# EAGLE schematic clouds_v30 (EAGLE 7.5.0)

## Sheet 1 of 4
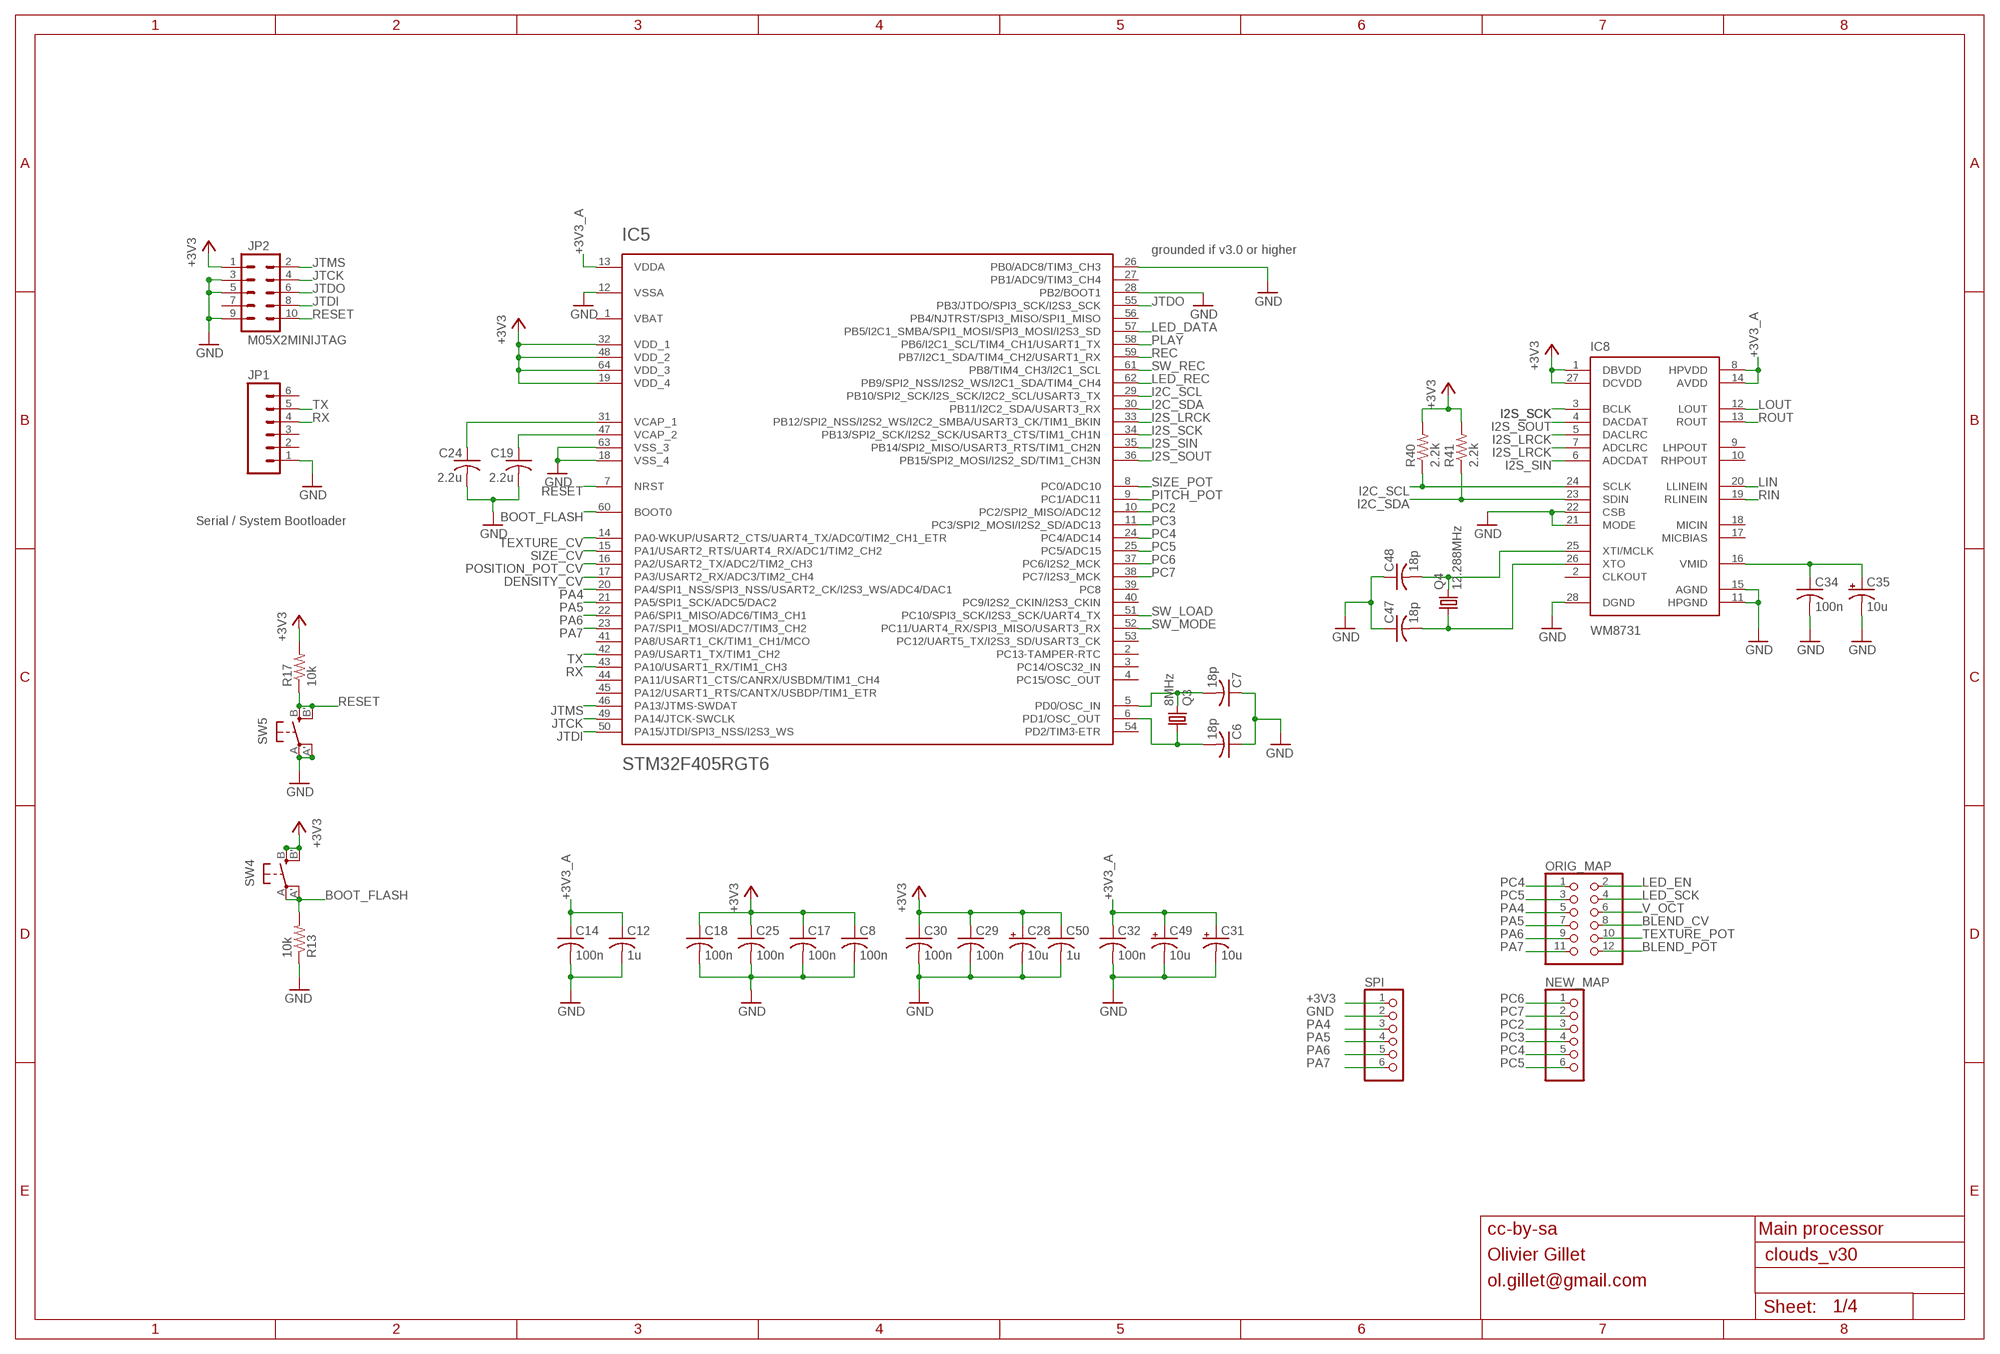
[diagram p0: schematic, sheet 1]

### Parts
C6  18p  C-USC0603  [C0603]
C7  18p  C-USC0603  [C0603]
C8  100n  C-USC0603  [C0603]
C12  1u  C-USC0603  [C0603]
C14  100n  C-USC0603  [C0603]
C17  100n  C-USC0603  [C0603]
C18  100n  C-USC0603  [C0603]
C19  2.2u  C-USC0805  [C0805]
C24  2.2u  C-USC0805  [C0805]
C25  100n  C-USC0603  [C0603]
C28  10u  CPOL-USA  [PANASONIC_A]
C29  100n  C-USC0603  [C0603]
C30  100n  C-USC0603  [C0603]
C31  10u  CPOL-USB  [PANASONIC_B]
C32  100n  C-USC0603  [C0603]
C34  100n  C-USC0603  [C0603]
C35  10u  CPOL-USB  [PANASONIC_B]
C47  18p  C-USC0603  [C0603]
C48  18p  C-USC0603  [C0603]
C49  10u  CPOL-USA  [PANASONIC_A]
C50  1u  C-USC0603  [C0603]
IC5  STM32F405RGT6  STM32F20X  [TQFP-10X10-64]
IC8  WM8731  [SSOP28]
JP1  M06SIP  [1X06]
JP2  M05X2MINIJTAG  [2X5-1.27]
NEW_MAP  PINHD-1X6  [1X06]
ORIG_MAP  PINHD-2X6  [2X06]
Q3  8MHz  CRYSTALHC49UP  [HC49UP]
Q4  12.288MHz  CRYSTALHC49UP  [HC49UP]
R13  10k  R-US_R0603  [R0603]
R17  10k  R-US_R0603  [R0603]
R40  2.2k  R-US_R0603  [R0603]
R41  2.2k  R-US_R0603  [R0603]
SPI  PINHD-1X6  [1X06]
SW4  EVQQ2  [EVQ-Q2]
SW5  EVQQ2  [EVQ-Q2]

### Nets
+3V3: C8.1 C17.1 C18.1 C25.1 C28.+ C29.1 C30.1 C50.1 IC5.19(VDD_4) IC5.32(VDD_1) IC5.48(VDD_2) IC5.64(VDD_3) IC8.1(DBVDD) IC8.27(DCVDD) JP2.1 R17.2 R40.2 R41.2 SPI.1 SW4.B'(S1) SW4.B(S) ; also sheet 3,4
+3V3_A: C12.1 C14.1 C31.+ C32.1 C49.+ IC5.13(VDDA) IC8.8(HPVDD) IC8.14(AVDD) ; also sheet 2,3,4
BLEND_CV: ORIG_MAP.8 ; also sheet 2
BLEND_POT: ORIG_MAP.12 ; also sheet 3
BOOT_FLASH: IC5.60(BOOT0) R13.2 SW4.A'(P1) SW4.A(P)
DENSITY_CV: IC5.17(PA3/USART2_RX/ADC3/TIM2_CH4) ; also sheet 2
GND: C6.1 C7.1 C8.2 C12.2 C14.2 C17.2 C18.2 C19.2 C24.2 C25.2 C28.- C29.2 C30.2 C31.- C32.2 C34.2 C35.- C47.1 C48.1 C49.- C50.2 IC5.12(VSSA) IC5.18(VSS_4) IC5.26(PB0/ADC8/TIM3_CH3) IC5.28(PB2/BOOT1) IC5.63(VSS_3) IC8.11(HPGND) IC8.15(AGND) IC8.21(MODE) IC8.22(CSB) IC8.28(DGND) JP1.1 JP2.3 JP2.5 JP2.9 R13.1 SPI.2 SW5.A'(P1) SW5.A(P) ; also sheet 2,3,4
I2C_SCL: IC5.29(PB10/SPI2_SCK/I2S_SCK/I2C2_SCL/USART3_TX) IC8.24(SCLK) R40.1
I2C_SDA: IC5.30(PB11/I2C2_SDA/USART3_RX) IC8.23(SDIN) R41.1
I2S_LRCK: IC5.33(PB12/SPI2_NSS/I2S2_WS/I2C2_SMBA/USART3_CK/TIM1_BKIN) IC8.5(DACLRC) IC8.7(ADCLRC)
I2S_SCK: IC5.34(PB13/SPI2_SCK/I2S2_SCK/USART3_CTS/TIM1_CH1N) IC8.3(BCLK)
I2S_SIN: IC5.35(PB14/SPI2_MISO/USART3_RTS/TIM1_CH2N) IC8.6(ADCDAT)
I2S_SOUT: IC5.36(PB15/SPI2_MOSI/I2S2_SD/TIM1_CH3N) IC8.4(DACDAT)
JTCK: IC5.49(PA14/JTCK-SWCLK) JP2.4
JTDI: IC5.50(PA15/JTDI/SPI3_NSS/I2S3_WS) JP2.8
JTDO: IC5.55(PB3/JTDO/SPI3_SCK/I2S3_SCK) JP2.6
JTMS: IC5.46(PA13/JTMS-SWDAT) JP2.2
LED_DATA: IC5.57(PB5/I2C1_SMBA/SPI1_MOSI/SPI3_MOSI/I2S3_SD) ; also sheet 3
LED_EN: ORIG_MAP.2 ; also sheet 3
LED_REC: IC5.62(PB9/SPI2_NSS/I2S2_WS/I2C1_SDA/TIM4_CH4) ; also sheet 3
LED_SCK: ORIG_MAP.4 ; also sheet 3
LIN: IC8.20(LLINEIN) ; also sheet 2
LOUT: IC8.12(LOUT) ; also sheet 2
N$7: C7.2 IC5.5(PD0/OSC_IN) Q3.2
N$8: C6.2 IC5.6(PD1/OSC_OUT) Q3.1
N$13: C19.1 IC5.47(VCAP_2)
N$17: C34.1 C35.+ IC8.16(VMID)
N$19: C24.1 IC5.31(VCAP_1)
N$59: C47.2 IC8.26(XTO) Q4.1
N$60: C48.2 IC8.25(XTI/MCLK) Q4.2
PA4: IC5.20(PA4/SPI1_NSS/SPI3_NSS/USART2_CK/I2S3_WS/ADC4/DAC1) ORIG_MAP.5 SPI.3
PA5: IC5.21(PA5/SPI1_SCK/ADC5/DAC2) ORIG_MAP.7 SPI.4
PA6: IC5.22(PA6/SPI1_MISO/ADC6/TIM3_CH1) ORIG_MAP.9 SPI.5
PA7: IC5.23(PA7/SPI1_MOSI/ADC7/TIM3_CH2) ORIG_MAP.11 SPI.6
PC2: IC5.10(PC2/SPI2_MISO/ADC12) NEW_MAP.3
PC3: IC5.11(PC3/SPI2_MOSI/I2S2_SD/ADC13) NEW_MAP.4
PC4: IC5.24(PC4/ADC14) NEW_MAP.5 ORIG_MAP.1
PC5: IC5.25(PC5/ADC15) NEW_MAP.6 ORIG_MAP.3
PC6: IC5.37(PC6/I2S2_MCK) NEW_MAP.1
PC7: IC5.38(PC7/I2S3_MCK) NEW_MAP.2
PITCH_POT: IC5.9(PC1/ADC11) ; also sheet 3
PLAY: IC5.58(PB6/I2C1_SCL/TIM4_CH1/USART1_TX) ; also sheet 3
POSITION_POT_CV: IC5.16(PA2/USART2_TX/ADC2/TIM2_CH3) ; also sheet 2
REC: IC5.59(PB7/I2C1_SDA/TIM4_CH2/USART1_RX) ; also sheet 3
RESET: IC5.7(NRST) JP2.10 R17.1 SW5.B'(S1) SW5.B(S)
RIN: IC8.19(RLINEIN) ; also sheet 2
ROUT: IC8.13(ROUT) ; also sheet 2
RX: IC5.43(PA10/USART1_RX/TIM1_CH3) JP1.4
SIZE_CV: IC5.15(PA1/USART2_RTS/UART4_RX/ADC1/TIM2_CH2) ; also sheet 2
SIZE_POT: IC5.8(PC0/ADC10) ; also sheet 3
SW_LOAD: IC5.51(PC10/SPI3_SCK/I2S3_SCK/UART4_TX) ; also sheet 3
SW_MODE: IC5.52(PC11/UART4_RX/SPI3_MISO/USART3_RX) ; also sheet 3
SW_REC: IC5.61(PB8/TIM4_CH3/I2C1_SCL) ; also sheet 3
TEXTURE_CV: IC5.14(PA0-WKUP/USART2_CTS/UART4_TX/ADC0/TIM2_CH1_ETR) ; also sheet 2
TEXTURE_POT: ORIG_MAP.10 ; also sheet 3
TX: IC5.42(PA9/USART1_TX/TIM1_CH2) JP1.5
V_OCT: ORIG_MAP.6 ; also sheet 2
Unconnected: IC5.2(PC13-TAMPER-RTC) IC5.3(PC14/OSC32_IN) IC5.4(PC15/OSC_OUT) IC5.27(PB1/ADC9/TIM3_CH4) IC5.39(PC8) IC5.40(PC9/I2S2_CKIN/I2S3_CKIN) IC5.41(PA8/USART1_CK/TIM1_CH1/MCO) IC5.44(PA11/USART1_CTS/CANRX/USBDM/TIM1_CH4) IC5.45(PA12/USART1_RTS/CANTX/USBDP/TIM1_ETR) IC5.53(PC12/UART5_TX/I2S3_SD/USART3_CK) IC5.54(PD2/TIM3-ETR) IC5.56(PB4/NJTRST/SPI3_MISO/SPI1_MISO) IC8.2(CLKOUT) IC8.9(LHPOUT) IC8.10(RHPOUT) IC8.17(MICBIAS) IC8.18(MICIN) JP1.2 JP1.3 JP1.6 JP2.7

### Notes on the sheet
- grounded if v3.0 or higher
- Serial / System Bootloader
- cc-by-sa | Main processor
- Olivier Gillet
- ol.gillet@gmail.com

## Sheet 2 of 4
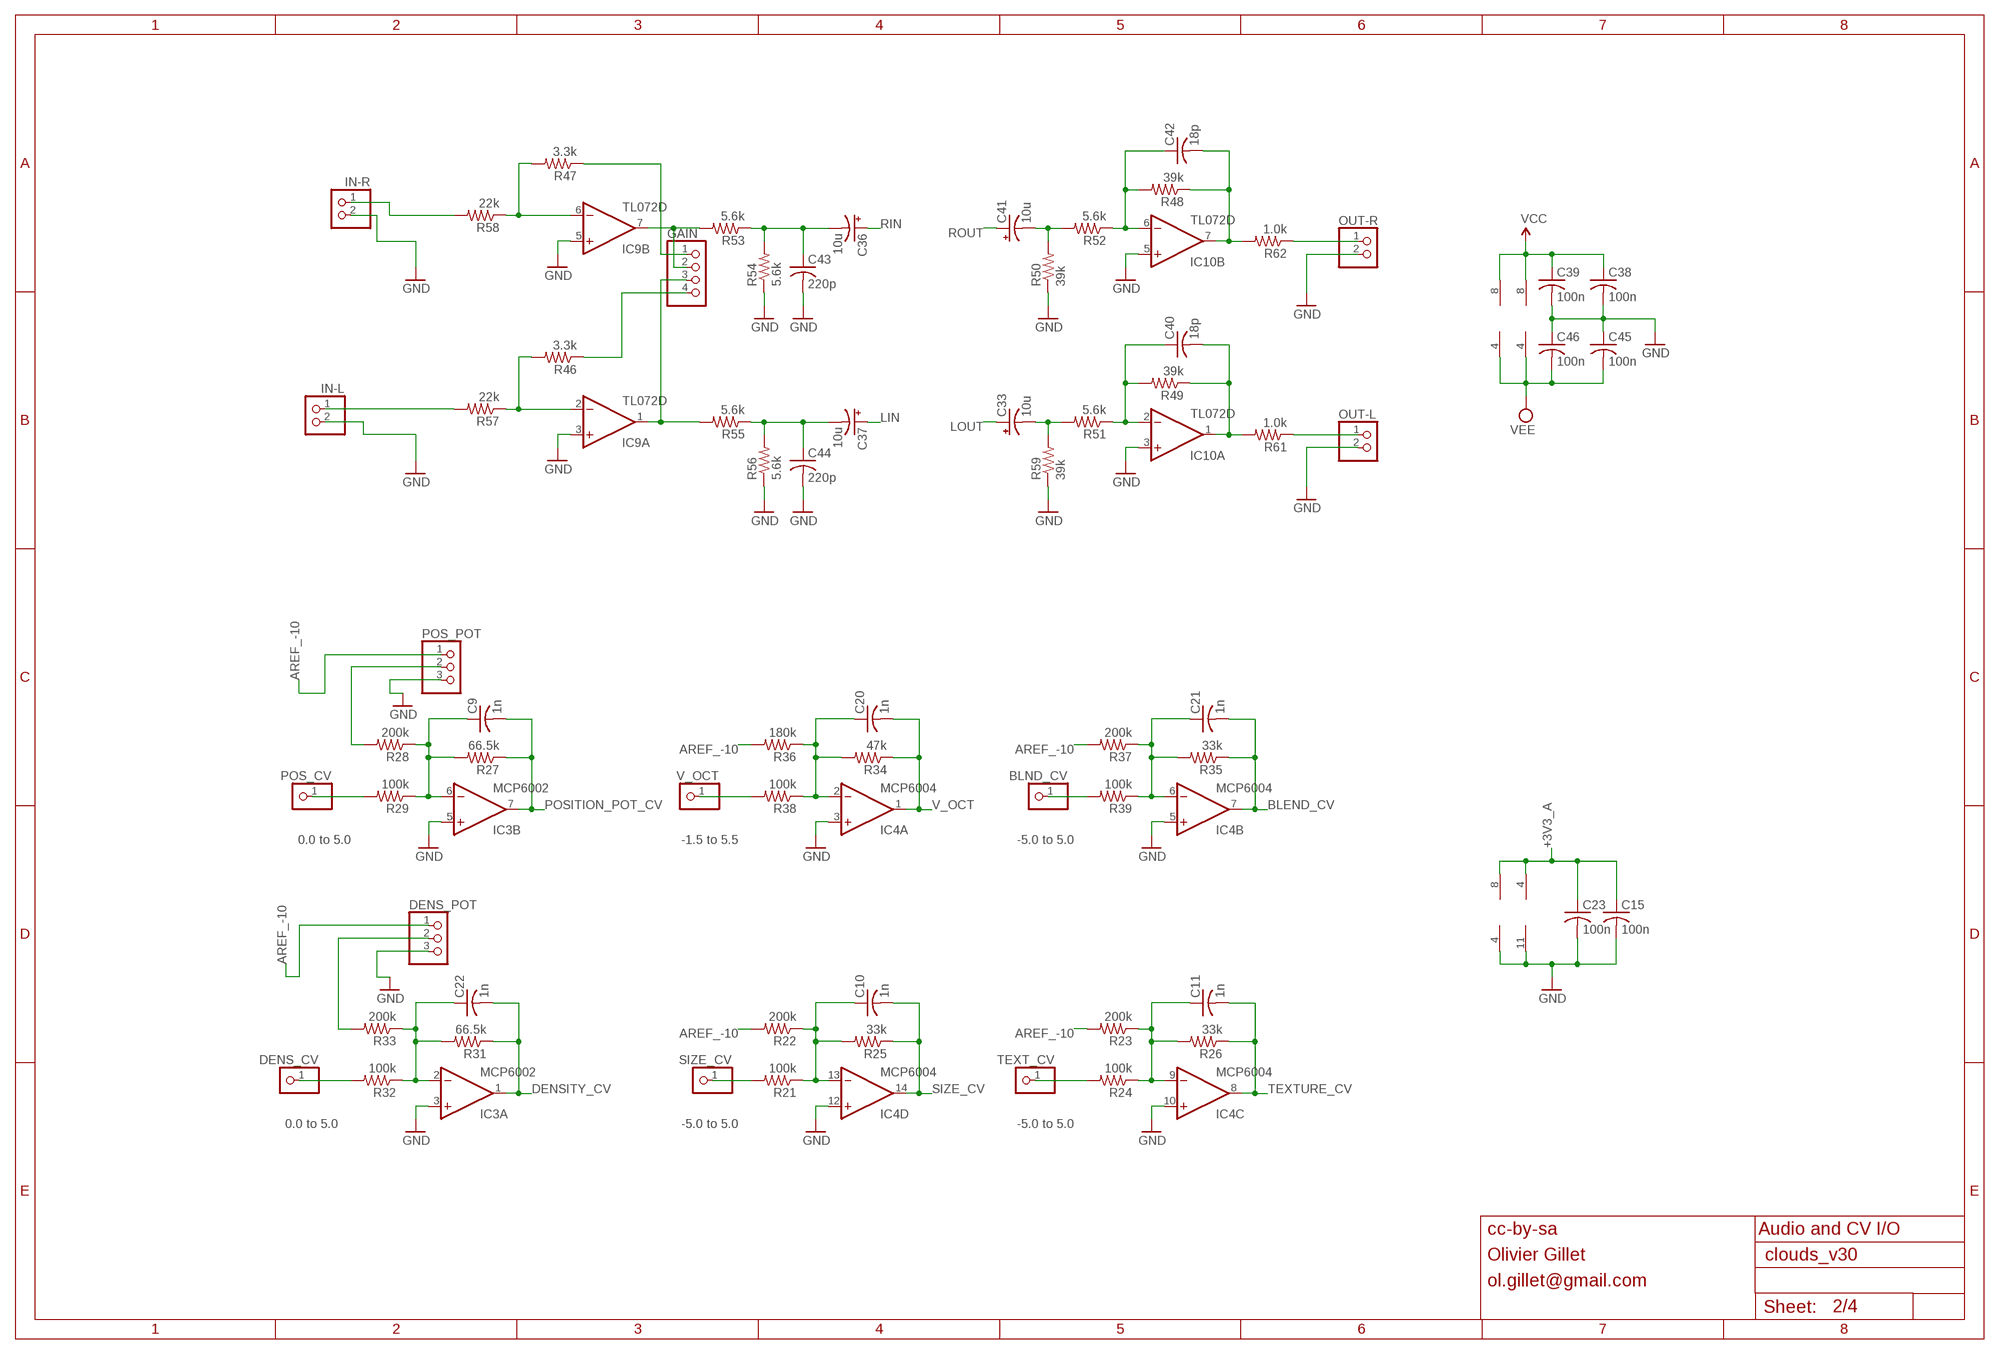
[diagram p1: schematic, sheet 2]

### Parts
BLND_CV  PINHD-1X1  [1X01]
C9  1n  C-USC0603  [C0603]
C10  1n  C-USC0603  [C0603]
C11  1n  C-USC0603  [C0603]
C15  100n  C-USC0603  [C0603]
C20  1n  C-USC0603  [C0603]
C21  1n  C-USC0603  [C0603]
C22  1n  C-USC0603  [C0603]
C23  100n  C-USC0603  [C0603]
C33  10u  CPOL-USB  [PANASONIC_B]
C36  10u  CPOL-USB  [PANASONIC_B]
C37  10u  CPOL-USB  [PANASONIC_B]
C38  100n  C-USC0603  [C0603]
C39  100n  C-USC0603  [C0603]
C40  18p  C-USC0603  [C0603]
C41  10u  CPOL-USB  [PANASONIC_B]
C42  18p  C-USC0603  [C0603]
C43  220p  C-USC0603  [C0603]
C44  220p  C-USC0603  [C0603]
C45  100n  C-USC0603  [C0603]
C46  100n  C-USC0603  [C0603]
DENS_CV  PINHD-1X1  [1X01]
DENS_POT  PINHD-1X3  [1X03]
GAIN  PINHD-1X4  [1X04]
IC3  MCP6002  TL072D  [SO08]
IC4  MCP6004  TL074D  [SO14]
IC9  TL072D  [SO08]
IC10  TL072D  [SO08]
IN-L  PINHD-1X2  [1X02]
IN-R  PINHD-1X2  [1X02]
OUT-L  PINHD-1X2  [1X02]
OUT-R  PINHD-1X2  [1X02]
POS_CV  PINHD-1X1  [1X01]
POS_POT  PINHD-1X3  [1X03]
R21  100k  R-US_R0603  [R0603]
R22  200k  R-US_R0603  [R0603]
R23  200k  R-US_R0603  [R0603]
R24  100k  R-US_R0603  [R0603]
R25  33k  R-US_R0603  [R0603]
R26  33k  R-US_R0603  [R0603]
R27  66.5k  R-US_R0603  [R0603]
R28  200k  R-US_R0603  [R0603]
R29  100k  R-US_R0603  [R0603]
R31  66.5k  R-US_R0603  [R0603]
R32  100k  R-US_R0603  [R0603]
R33  200k  R-US_R0603  [R0603]
R34  47k  R-US_R0603  [R0603]
R35  33k  R-US_R0603  [R0603]
R36  180k  R-US_R0603  [R0603]
R37  200k  R-US_R0603  [R0603]
R38  100k  R-US_R0603  [R0603]
R39  100k  R-US_R0603  [R0603]
R46  3.3k  R-US_R0603  [R0603]
R47  3.3k  R-US_R0603  [R0603]
R48  39k  R-US_R0603  [R0603]
R49  39k  R-US_R0603  [R0603]
R50  39k  R-US_R0603  [R0603]
R51  5.6k  R-US_R0603  [R0603]
R52  5.6k  R-US_R0603  [R0603]
R53  5.6k  R-US_R0603  [R0603]
R54  5.6k  R-US_R0603  [R0603]
R55  5.6k  R-US_R0603  [R0603]
R56  5.6k  R-US_R0603  [R0603]
R57  22k  R-US_R0603  [R0603]
R58  22k  R-US_R0603  [R0603]
R59  39k  R-US_R0603  [R0603]
R61  1.0k  R-US_R0603  [R0603]
R62  1.0k  R-US_R0603  [R0603]
SIZE_CV  PINHD-1X1  [1X01]
TEXT_CV  PINHD-1X1  [1X01]
V_OCT  PINHD-1X1  [1X01]

### Nets
+3V3_A: C15.1 C23.1 IC3.8(P:V+) IC4.4(P:V+) ; also sheet 1,3,4
AREF_-10: DENS_POT.1 POS_POT.1 R22.2 R23.2 R36.2 R37.2 ; also sheet 4
BLEND_CV: C21.2 IC4.7(B:OUT) R35.1 ; also sheet 1
DENSITY_CV: C22.2 IC3.1(A:OUT) R31.1 ; also sheet 1
GND: C15.2 C23.2 C38.2 C39.2 C43.2 C44.2 C45.1 C46.1 DENS_POT.3 IC3.3(A:+IN) IC3.4(P:V-) IC3.5(B:+IN) IC4.3(A:+IN) IC4.5(B:+IN) IC4.10(C:+IN) IC4.11(P:V-) IC4.12(D:+IN) IC9.3(A:+IN) IC9.5(B:+IN) IC10.3(A:+IN) IC10.5(B:+IN) IN-L.2 IN-R.2 OUT-L.2 OUT-R.2 POS_POT.3 R50.1 R54.1 R56.1 R59.1 ; also sheet 1,3,4
LIN: C37.+ ; also sheet 1
LOUT: C33.+ ; also sheet 1
LOUT_JACK: OUT-L.1 R61.1
N$1: R21.2 SIZE_CV.1
N$2: C10.1 IC4.13(D:-IN) R21.1 R22.1 R25.2
N$4: R24.2 TEXT_CV.1
N$5: C11.1 IC4.9(C:-IN) R23.1 R24.1 R26.2
N$6: BLND_CV.1 R39.2
N$10: R38.2 V_OCT.1
N$11: C20.1 IC4.2(A:-IN) R34.2 R36.1 R38.1
N$14: DENS_CV.1 R32.2
N$15: C21.1 IC4.6(B:-IN) R35.2 R37.1 R39.1
N$18: C37.- C44.1 R55.1 R56.2
N$20: IN-R.1 R58.2
N$21: IN-L.1 R57.2
N$22: C36.- C43.1 R53.1 R54.2
N$23: C41.- R50.2 R52.2
N$24: C22.1 IC3.2(A:-IN) R31.2 R32.1 R33.1
N$25: C42.1 IC10.6(B:-IN) R48.2 R52.1
N$26: DENS_POT.2 R33.2
N$27: POS_CV.1 R29.2
N$28: C42.2 IC10.7(B:OUT) R48.1 R62.2
N$30: C9.1 IC3.6(B:-IN) R27.2 R28.1 R29.1
N$31: C33.- R51.2 R59.2
N$32: C40.1 IC10.2(A:-IN) R49.2 R51.1
N$33: C40.2 IC10.1(A:OUT) R49.1 R61.2
N$35: POS_POT.2 R28.2
N$42: GAIN.2 IC9.7(B:OUT) R53.2
N$51: GAIN.3 IC9.1(A:OUT) R55.2
N$52: GAIN.1 R47.1
N$53: GAIN.4 R46.1
N$54: IC9.6(B:-IN) R47.2 R58.1
N$58: IC9.2(A:-IN) R46.2 R57.1
POSITION_POT_CV: C9.2 IC3.7(B:OUT) R27.1 ; also sheet 1
RIN: C36.+ ; also sheet 1
ROUT: C41.+ ; also sheet 1
ROUT_JACK: OUT-R.1 R62.1
SIZE_CV: C10.2 IC4.14(D:OUT) R25.1 ; also sheet 1
TEXTURE_CV: C11.2 IC4.8(C:OUT) R26.1 ; also sheet 1
V_OCT: C20.2 IC4.1(A:OUT) R34.1 ; also sheet 1
VCC: C38.1 C39.1 IC9.8(P:V+) IC10.8(P:V+) ; also sheet 4
VEE: C45.2 C46.2 IC9.4(P:V-) IC10.4(P:V-) ; also sheet 4

### Notes on the sheet
- 0.0 to 5.0 | -1.5 to 5.5 | -5.0 to 5.0
- 0.0 to 5.0 | -5.0 to 5.0 | -5.0 to 5.0
- cc-by-sa | Audio and CV I/O
- Olivier Gillet
- ol.gillet@gmail.com

## Sheet 3 of 4
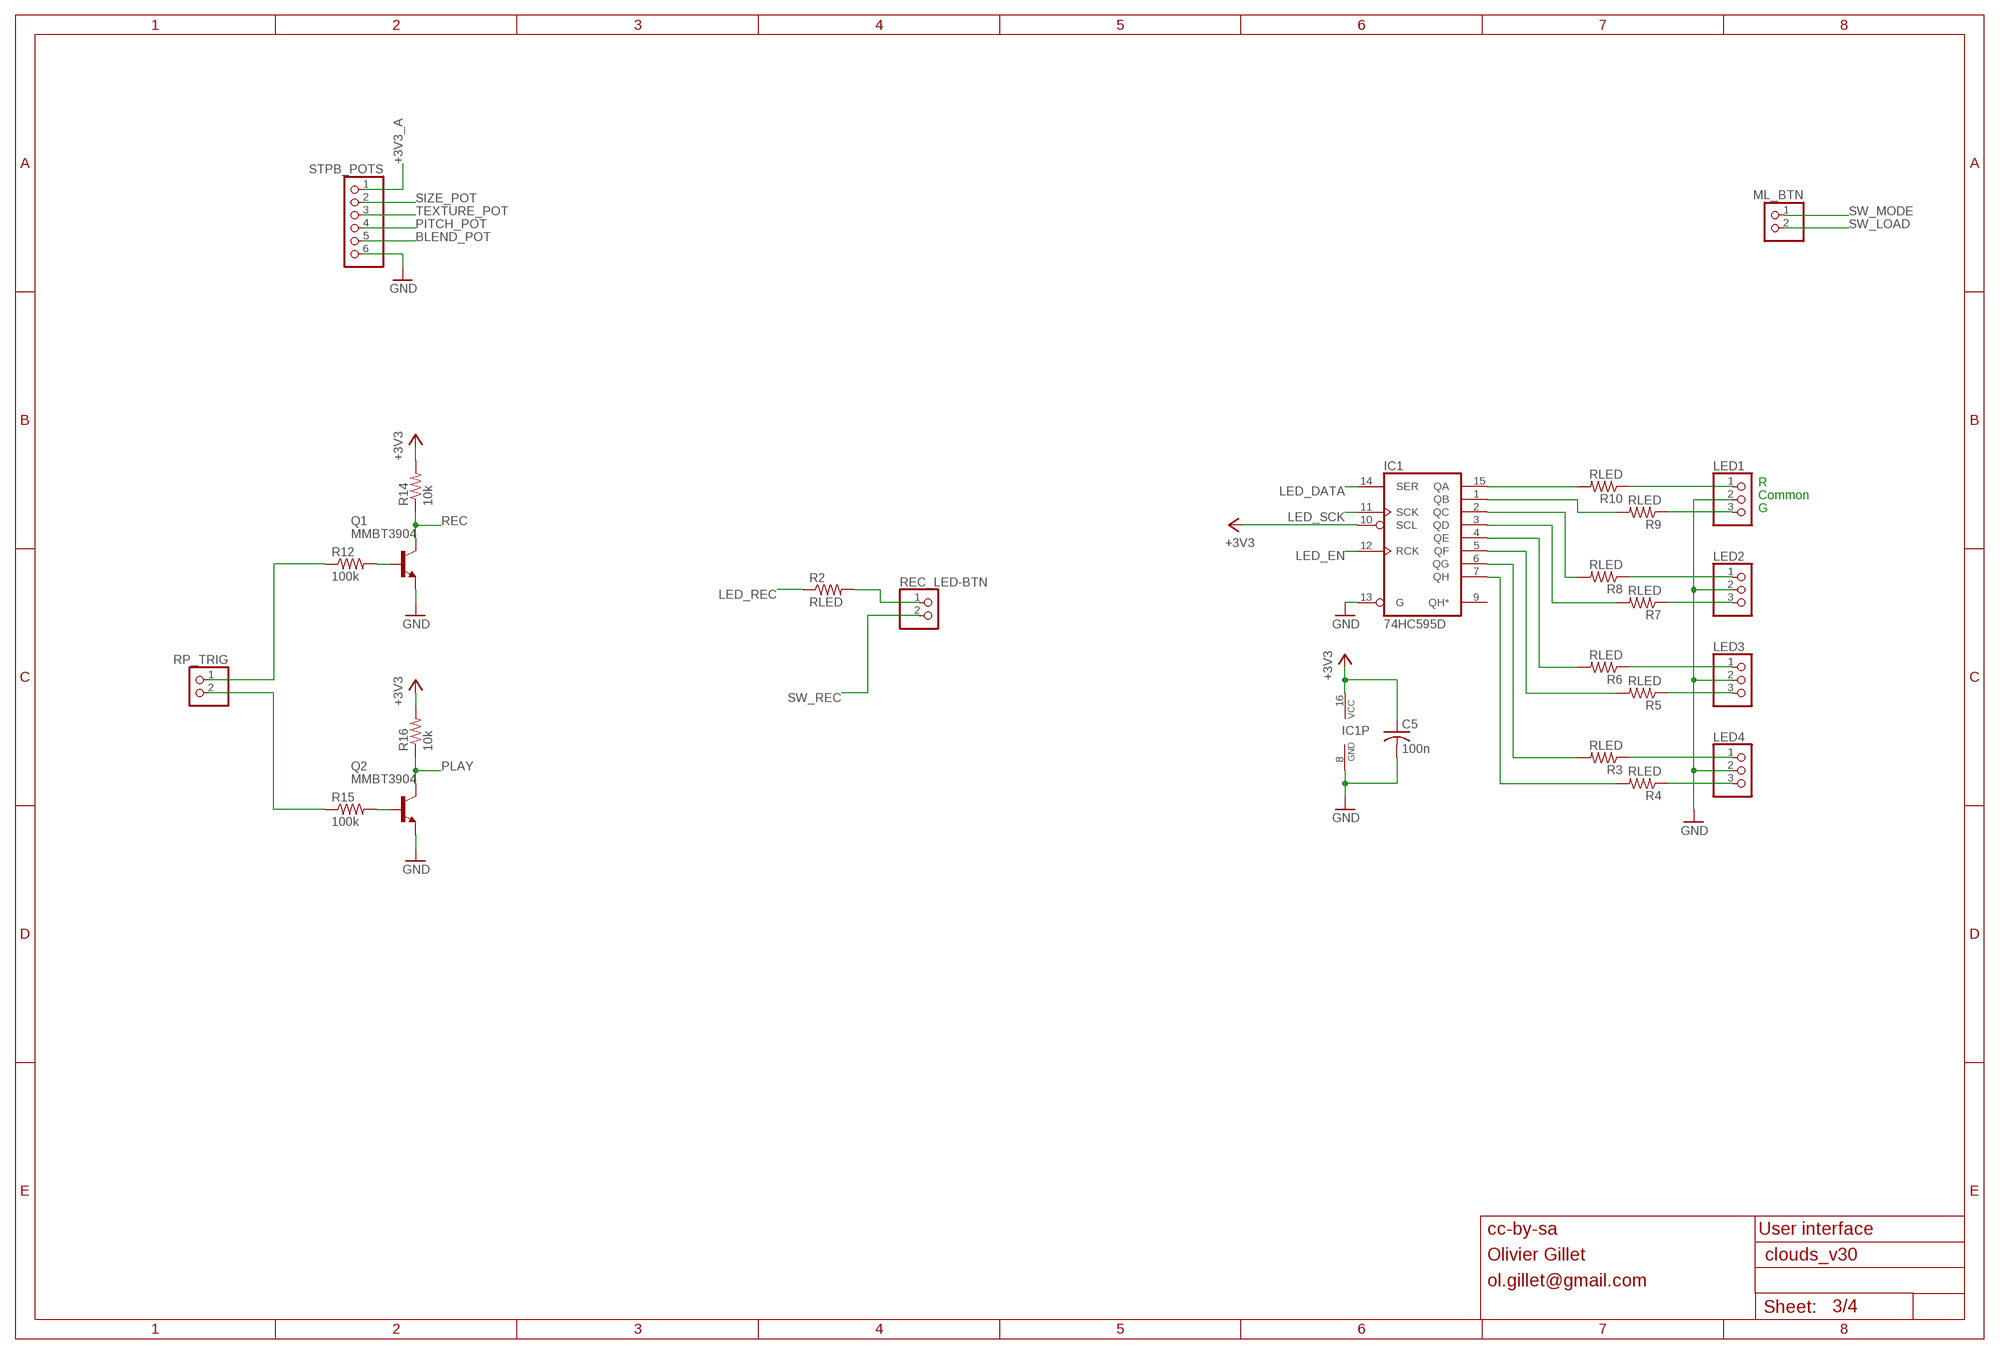
[diagram p2: schematic, sheet 3]

### Parts
C5  100n  C-USC0603  [C0603]
IC1  74HC595D  [SO16]
LED1  PINHD-1X3  [1X03]
LED2  PINHD-1X3  [1X03]
LED3  PINHD-1X3  [1X03]
LED4  PINHD-1X3  [1X03]
ML_BTN  PINHD-1X2  [1X02]
Q1  MMBT3904  MMBT3904LT1-NPN-SOT23-BEC  [SOT23-BEC]
Q2  MMBT3904  MMBT3904LT1-NPN-SOT23-BEC  [SOT23-BEC]
R2  RLED  R-US_R0603  [R0603]
R3  RLED  R-US_R0603  [R0603]
R4  RLED  R-US_R0603  [R0603]
R5  RLED  R-US_R0603  [R0603]
R6  RLED  R-US_R0603  [R0603]
R7  RLED  R-US_R0603  [R0603]
R8  RLED  R-US_R0603  [R0603]
R9  RLED  R-US_R0603  [R0603]
R10  RLED  R-US_R0603  [R0603]
R12  100k  R-US_R0603  [R0603]
R14  10k  R-US_R0603  [R0603]
R15  100k  R-US_R0603  [R0603]
R16  10k  R-US_R0603  [R0603]
REC_LED-BTN  PINHD-1X2  [1X02]
RP_TRIG  PINHD-1X2  [1X02]
STPB_POTS  PINHD-1X6  [1X06]

### Nets
+3V3: C5.1 IC1.10(SCL) IC1.16(VCC) R14.2 R16.2 ; also sheet 1,4
+3V3_A: STPB_POTS.1 ; also sheet 1,2,4
BLEND_POT: STPB_POTS.5 ; also sheet 1
GND: C5.2 IC1.8(GND) IC1.13(G) LED1.2 LED2.2 LED3.2 LED4.2 Q1.E Q2.E STPB_POTS.6 ; also sheet 1,2,4
LED_DATA: IC1.14(SER) ; also sheet 1
LED_EN: IC1.12(RCK) ; also sheet 1
LED_REC: R2.1 ; also sheet 1
LED_SCK: IC1.11(SCK) ; also sheet 1
N$9: LED1.3 R9.1
N$12: LED1.1 R10.1
N$16: LED2.1 R8.1
N$29: LED2.3 R7.1
N$34: LED3.1 R6.1
N$36: R15.1 RP_TRIG.2
N$37: Q2.B R15.2
N$38: R2.2 REC_LED-BTN.1
N$39: LED3.3 R5.1
N$40: LED4.1 R3.1
N$41: LED4.3 R4.1
N$43: IC1.15(QA) R10.2
N$44: IC1.1(QB) R9.2
N$45: IC1.2(QC) R8.2
N$46: IC1.3(QD) R7.2
N$47: IC1.4(QE) R6.2
N$48: IC1.5(QF) R5.2
N$49: IC1.6(QG) R3.2
N$50: IC1.7(QH) R4.2
N$57: R12.1 RP_TRIG.1
N$66: Q1.B R12.2
PITCH_POT: STPB_POTS.4 ; also sheet 1
PLAY: Q2.C R16.1 ; also sheet 1
REC: Q1.C R14.1 ; also sheet 1
SIZE_POT: STPB_POTS.2 ; also sheet 1
SW_LOAD: ML_BTN.2 ; also sheet 1
SW_MODE: ML_BTN.1 ; also sheet 1
SW_REC: REC_LED-BTN.2 ; also sheet 1
TEXTURE_POT: STPB_POTS.3 ; also sheet 1
Unconnected: IC1.9(QH*)

### Notes on the sheet
- R
- Common
- G
- cc-by-sa | User interface
- Olivier Gillet
- ol.gillet@gmail.com

## Sheet 4 of 4
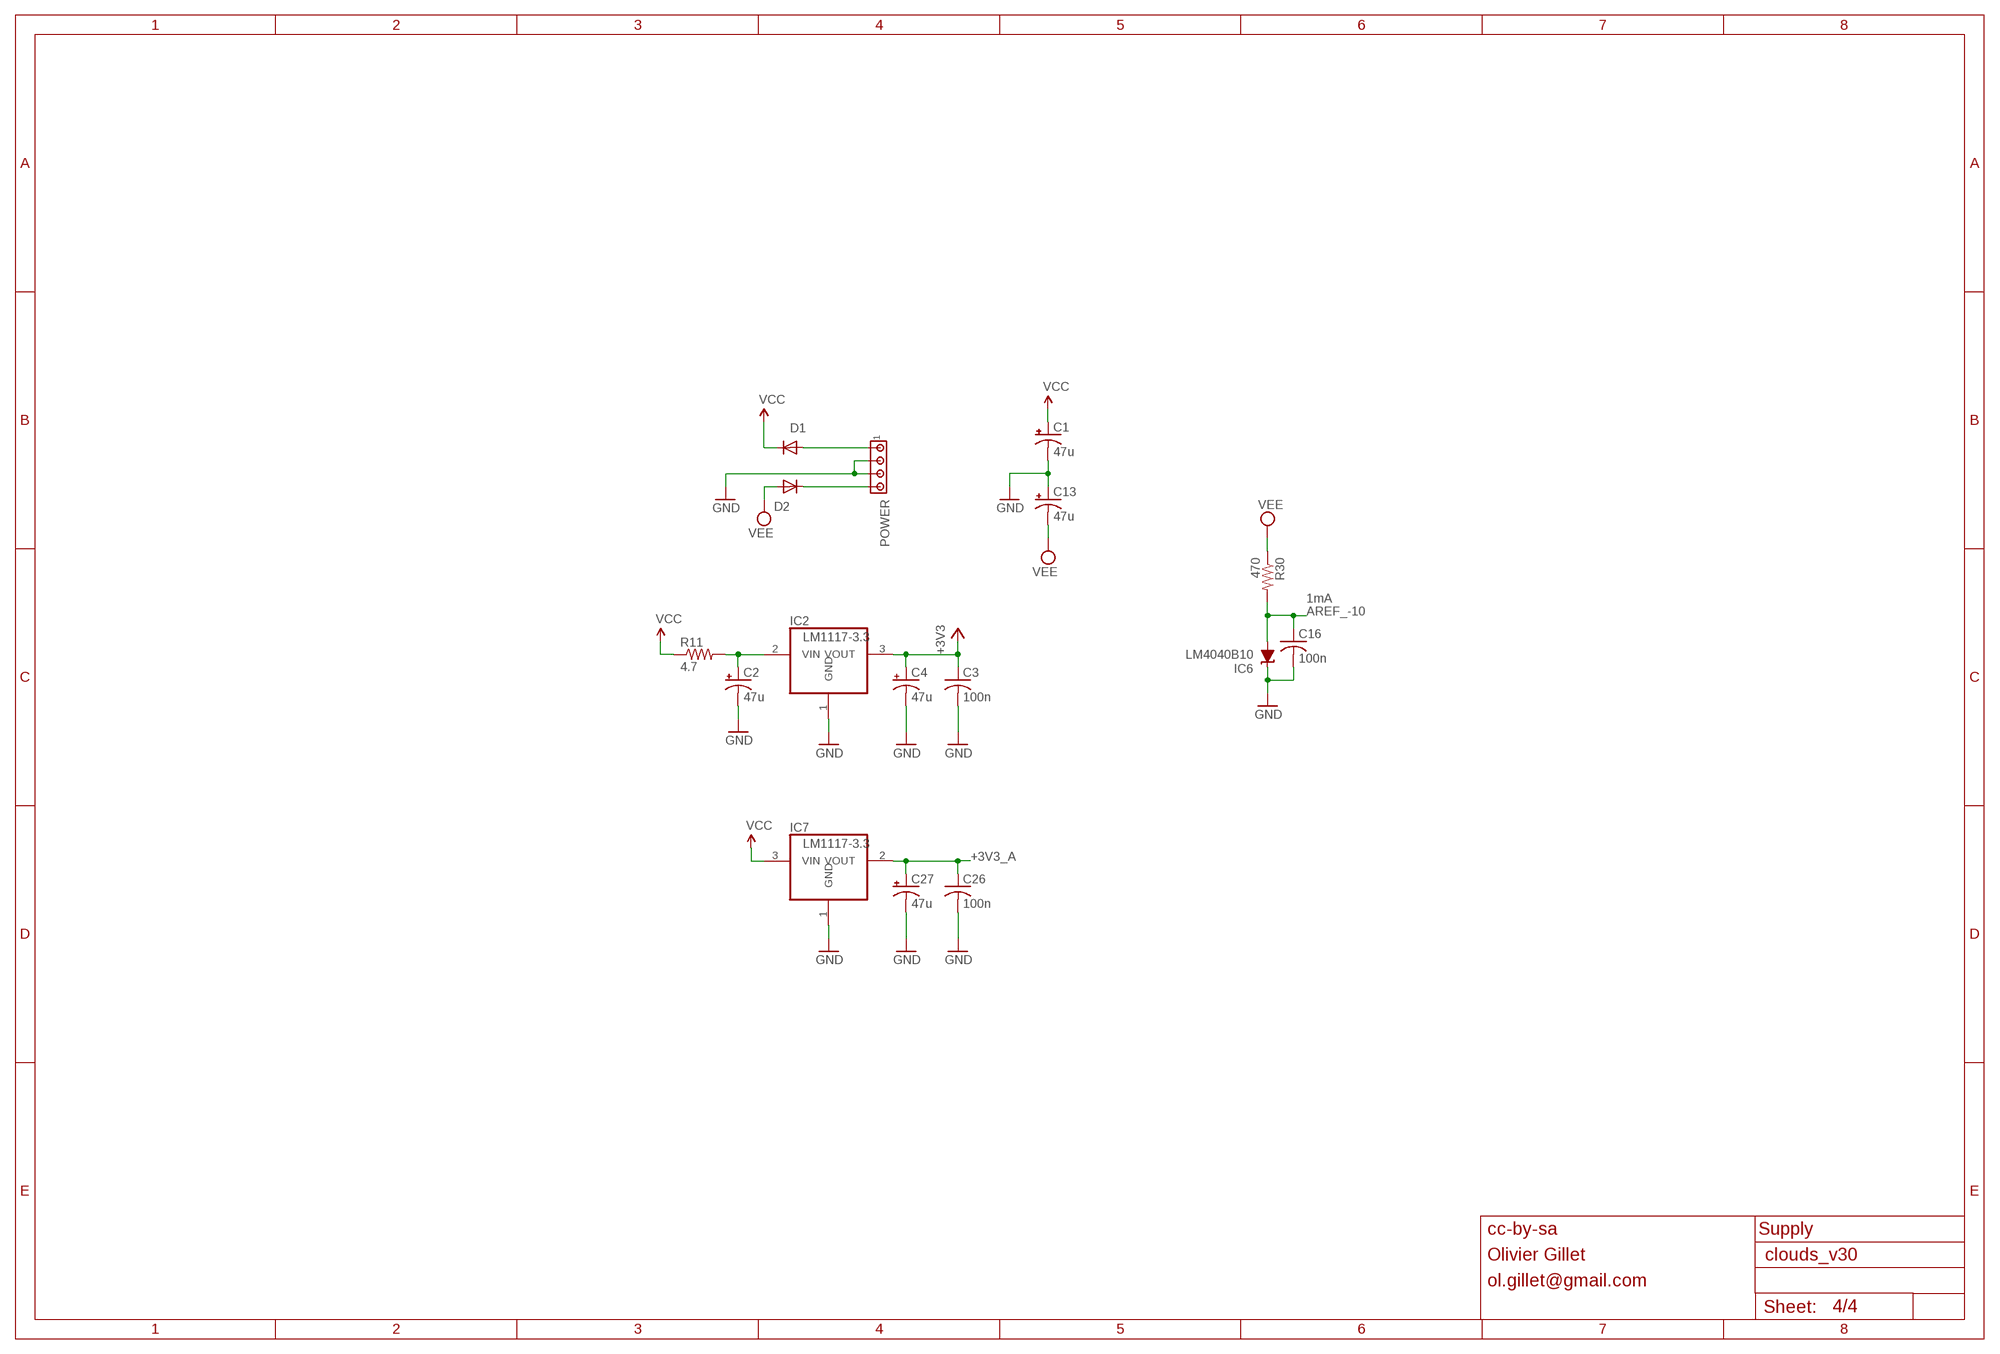
[diagram p3: schematic, sheet 4]

### Parts
C1  47u  CPOL-USD  [PANASONIC_D]
C2  47u  CPOL-USD  [PANASONIC_D]
C3  100n  C-USC0603  [C0603]
C4  47u  CPOL-USD  [PANASONIC_D]
C13  47u  CPOL-USD  [PANASONIC_D]
C16  100n  C-USC0603  [C0603]
C26  100n  C-USC0603  [C0603]
C27  47u  CPOL-USD  [PANASONIC_D]
D1  1N5819HW  DIODE-SOD123  [SOD123]
D2  1N5819HW  DIODE-SOD123  [SOD123]
IC2  LM1117-3.3  REG1117T  [TO252]
IC6  LM4040B10  LM4041B12DBZ  [DBZ_R-PDSO-G3]
IC7  LM1117-3.3  REG1117  [SOT223]
POWER  MTA04-156  [1X4MTA]
R11  4.7  R-US_R1206  [R1206]
R30  470  R-US_R0603  [R0603]

### Nets
+3V3: C3.1 C4.+ IC2.3(VOUT) ; also sheet 1,3
+3V3_A: C26.1 C27.+ IC7.2(VOUT) ; also sheet 1,2,3
AREF_-10: C16.1 IC6.2(A) R30.2 ; also sheet 2
GND: C1.- C2.- C3.2 C4.- C13.+ C16.2 C26.2 C27.- IC2.1(GND) IC6.1(C) IC7.1(GND) POWER.2 POWER.3 ; also sheet 1,2,3
N$55: C2.+ IC2.2(VIN) R11.2
N$56: D1.A POWER.1
N$64: D2.C POWER.4
VCC: C1.+ D1.C IC7.3(VIN) R11.1 ; also sheet 2
VEE: C13.- D2.A R30.1 ; also sheet 2

### Notes on the sheet
- 1mA
- cc-by-sa | Supply
- Olivier Gillet
- ol.gillet@gmail.com

## Power pins joined to a net without a drawn wire
VBAT: IC5.1(VBAT)

## Library data of the parts
BLND_CV DENS_CV POS_CV SIZE_CV TEXT_CV V_OCT = pinhead:PINHD-1X1: PIN HEADER
C1 C2 C4 C13 C27 C28 C31 C33 C35-C37 C41 C49 = rcl:CPOL-US: POLARIZED CAPACITOR, American symbol
C3 C5-C12 C14-C26 C29 C30 C32 C34 C38-C40 C42-C48 C50 = rcl:C-US: CAPACITOR, American symbol
D1 D2 = diode:DIODE-: DIODE
DENS_POT LED1-LED4 POS_POT = pinhead:PINHD-1X3: PIN HEADER
GAIN = pinhead:PINHD-1X4: PIN HEADER
IC1 = 74xx-eu:74*595: 8-bit SHIFT REGISTER, output latch
IC2 IC7 = og-vreg:REG1117: 800mA and 1A Low Dropout (LDO) Positive Regulator 1.8V, 2.5V, 2.85V, 3.3V, 5V, and Adj
IC3 = gm-ics:TL072: OP AMP
IC4 = gm-ics:TL074: OP AMP
IC5 = og-stm32f2:STM32F20X
IC6 = texas:LM4041: PRECISION MICROPOWER SHUNT VOLTAGE REFERENCE Source: http://focus.ti.com/lit/ds/slcs146e/slcs146e.pdf
IC8 = og-dac:WM8731
IC9 IC10 = og-linear:TL072: OP AMP
IN-L IN-R ML_BTN OUT-L OUT-R REC_LED-BTN RP_TRIG = pinhead:PINHD-1X2: PIN HEADER
JP1 = SparkFun:M06: Header 6 Standard 6-pin 0.1" header. Use with straight break away headers (SKU : PRT-00116), right angle break away headers (PRT-00553), swiss pins (PRT-00743), machine pins (PRT-00117), and female headers (PRT-00115). Molex polarized connector foot print use with SKU : PRT-08094 with associated crimp pins and housings. NOTES ON THE VARIANTS LOCK and LOCK_LONGPADS... This footprint was designed to help hold the alignment of a through-hole component (i.e. 6-pin header) while soldering it into place. You may notice that each hole has been shifted either up or down by 0.005 of an inch from it's more standard position (which is a perfectly straight line). This slight alteration caused the pins (the squares in the middle) to touch the edges of the holes. Because they are alternating, it causes a "brace" to hold the component in place. 0.005 has proven to be the perfect amount of "off-center" position when using our standard breakaway headers. Although looks a little odd when you look at the bare footprint, once you have a header in there, the alteration is very hard to notice. Also, if you push a header all the way into place, it is covered up entirely on the bottom side. This idea of altering the position of holes to aid alignment will be further integrated into the Sparkfun Library for other footprints. It can help hold any component with 3 or more connection pins.
JP2 = og-header:M05X2: Header 5x2 Standard 10-pin dual row 0.1" header. Commonly used with AVR-ISP. Use with Spark Fun Electronics SKU: PRT-00778
NEW_MAP SPI STPB_POTS = pinhead:PINHD-1X6: PIN HEADER
ORIG_MAP = pinhead:PINHD-2X6: PIN HEADER
POWER = con-amp:MTA04-156: AMP connector
Q1 Q2 = transistor:*-NPN-: NPN Transistror BF959 corrected 2008.03.06
Q3 Q4 = crystal:CRYSTAL: CRYSTAL
R2-R17 R21-R41 R46-R59 R61 R62 = rcl:R-US_: RESISTOR, American symbol
SW4 SW5 = adafruit:EVQQ2: SMT 6mm switch, EVQQ2 series http://www.ladyada.net/library/eagle